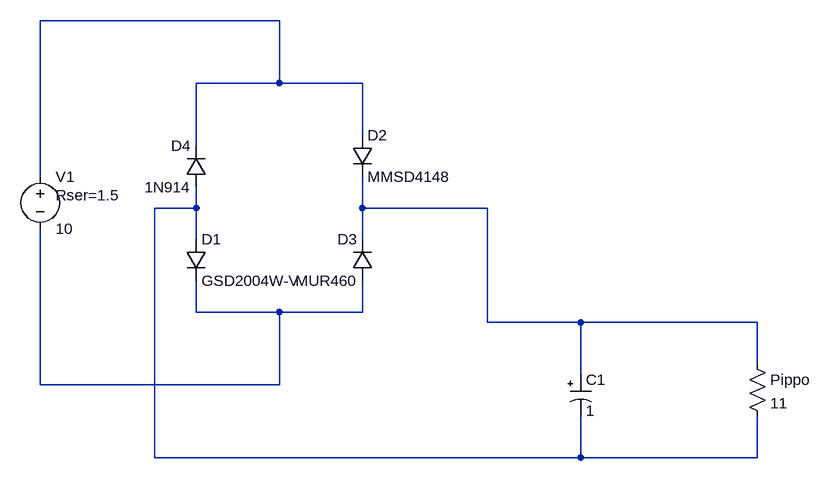
[diagram p0: schematic Test4.asc]
Test4.asc, the LTspice schematic file:
Version 4
SHEET 1 880 680
WIRE -32 -304 -400 -304
WIRE -32 -208 -32 -304
WIRE -32 -208 -160 -208
WIRE 96 -208 -32 -208
WIRE 96 -128 96 -208
WIRE -160 -112 -160 -208
WIRE -400 -64 -400 -304
WIRE -160 -16 -160 -48
WIRE -160 -16 -224 -16
WIRE 96 -16 96 -64
WIRE 288 -16 96 -16
WIRE -160 32 -160 -16
WIRE 96 32 96 -16
WIRE -160 144 -160 96
WIRE -32 144 -160 144
WIRE 96 144 96 96
WIRE 96 144 -32 144
WIRE 288 160 288 -16
WIRE 432 160 288 160
WIRE 704 160 432 160
WIRE 704 224 704 160
WIRE 432 240 432 160
WIRE -400 256 -400 16
WIRE -32 256 -32 144
WIRE -32 256 -400 256
WIRE -224 368 -224 -16
WIRE 432 368 432 304
WIRE 432 368 -224 368
WIRE 704 368 704 304
WIRE 704 368 432 368
SYMBOL diode -176 32 R0
SYMATTR InstName D1
SYMATTR Value GSD2004W-V
SYMBOL diode 80 -128 R0
SYMATTR InstName D2
SYMATTR Value MMSD4148
SYMBOL diode 112 96 R180
WINDOW 0 24 64 Left 2
WINDOW 3 24 0 Left 2
SYMATTR InstName D3
SYMATTR Value MUR460
SYMBOL diode -144 -48 R180
WINDOW 0 24 64 Left 2
WINDOW 3 24 0 Left 2
SYMATTR InstName D4
SYMATTR Value 1N914
SYMBOL voltage -400 -80 R0
WINDOW 123 0 0 Left 0
WINDOW 39 24 44 Left 2
SYMATTR InstName V1
SYMATTR Value 10
SYMATTR SpiceLine Rser=1.5
SYMBOL res 688 208 R0
SYMATTR InstName Pippo
SYMATTR Value 11
SYMATTR SpiceLine tol=1 pwr=0.1
SYMBOL polcap 416 240 R0
WINDOW 3 24 56 Left 2
SYMATTR InstName C1
SYMATTR Value 1
SYMATTR Description Capacitor
SYMATTR Type cap
SYMATTR SpiceLine V=ABC Irms=0 Rser=11 Lser=0

The netlist it stands for:
* Test4.asc
D1 N002 N004 GSD2004W-V
D2 N001 N003 MMSD4148
D3 N004 N003 MUR460
D4 N002 N001 1N914
V1 N001 N004 10 Rser=1.5
R§Pippo N003 N002 11 tol=1 pwr=0.1
C1 N003 N002 1 V=ABC Irms=0 Rser=11 Lser=0
.model D D
.lib standard.dio
.backanno
.end